# Altium schematic sheet power.SchDoc
size A2
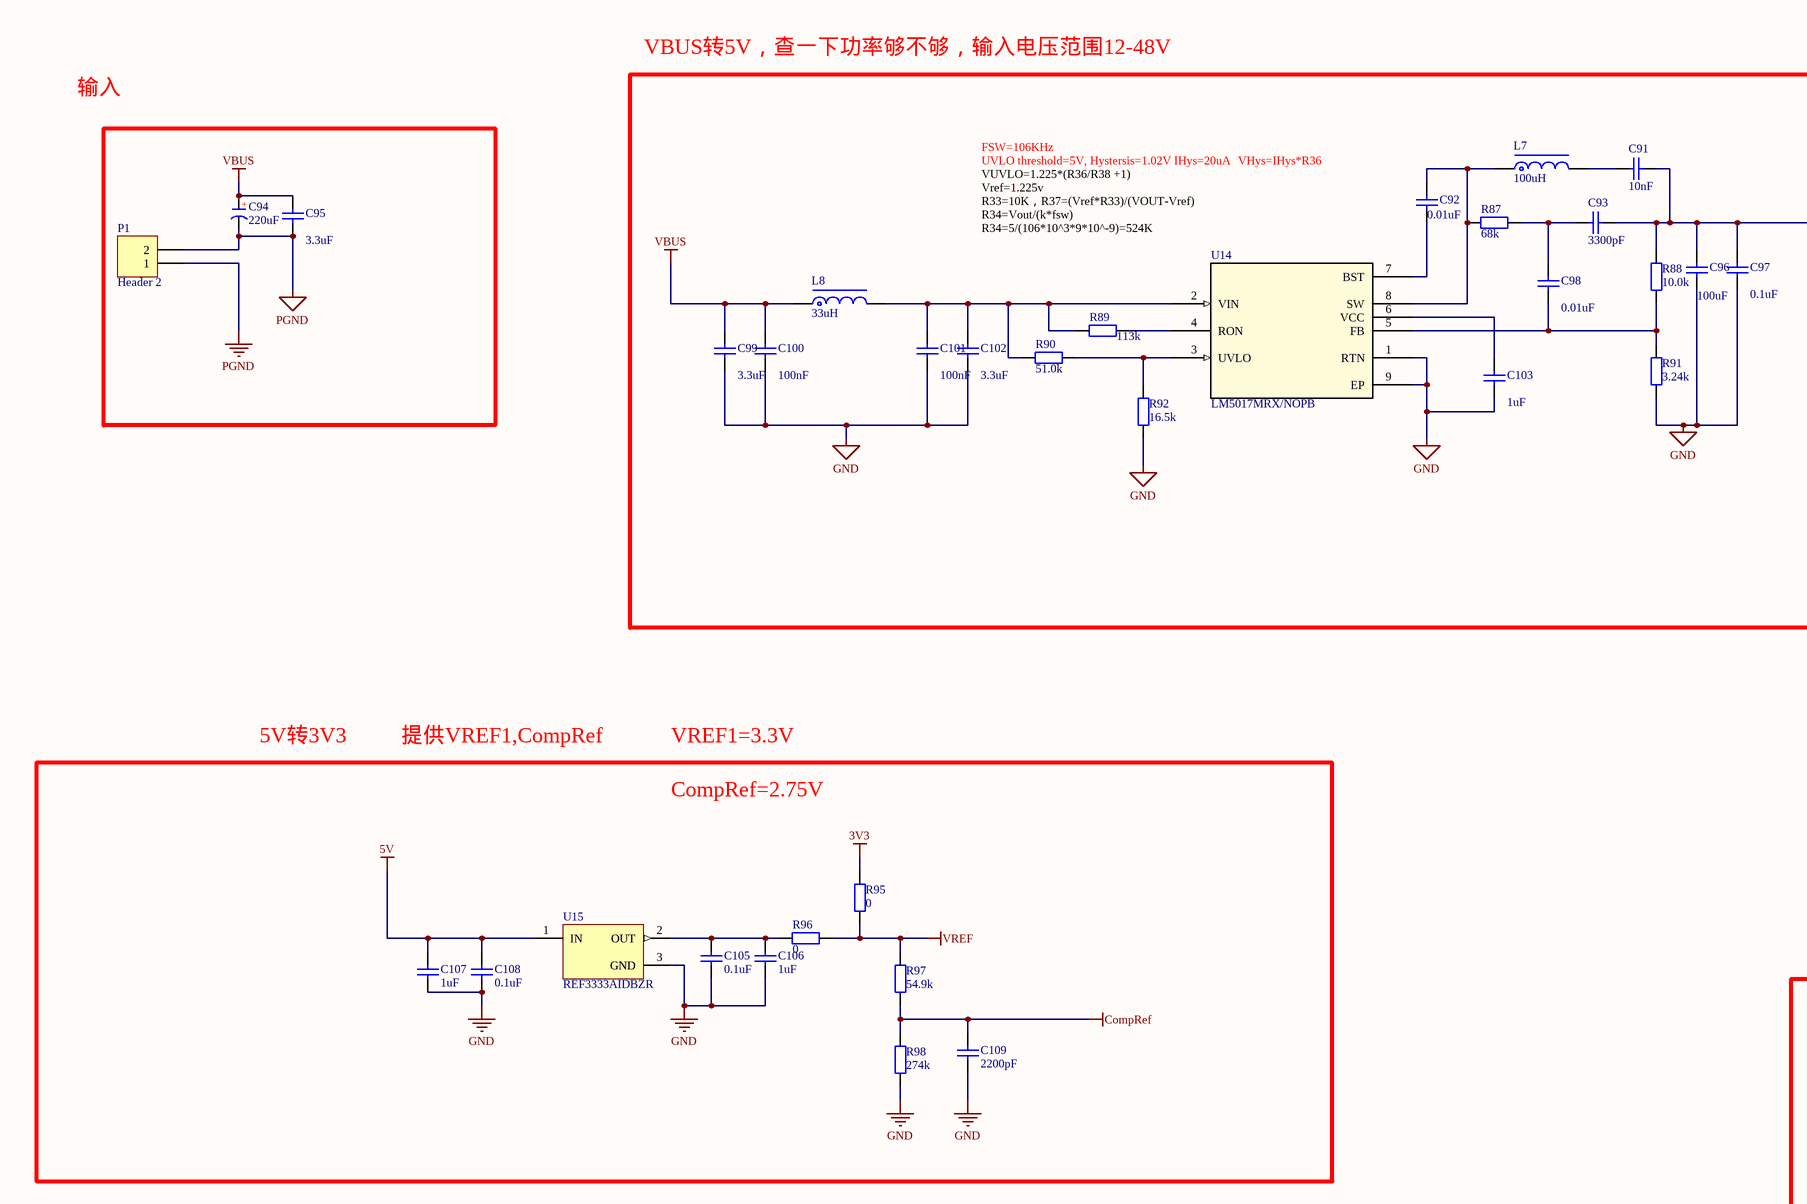
[diagram p0: power.SchDoc, left]
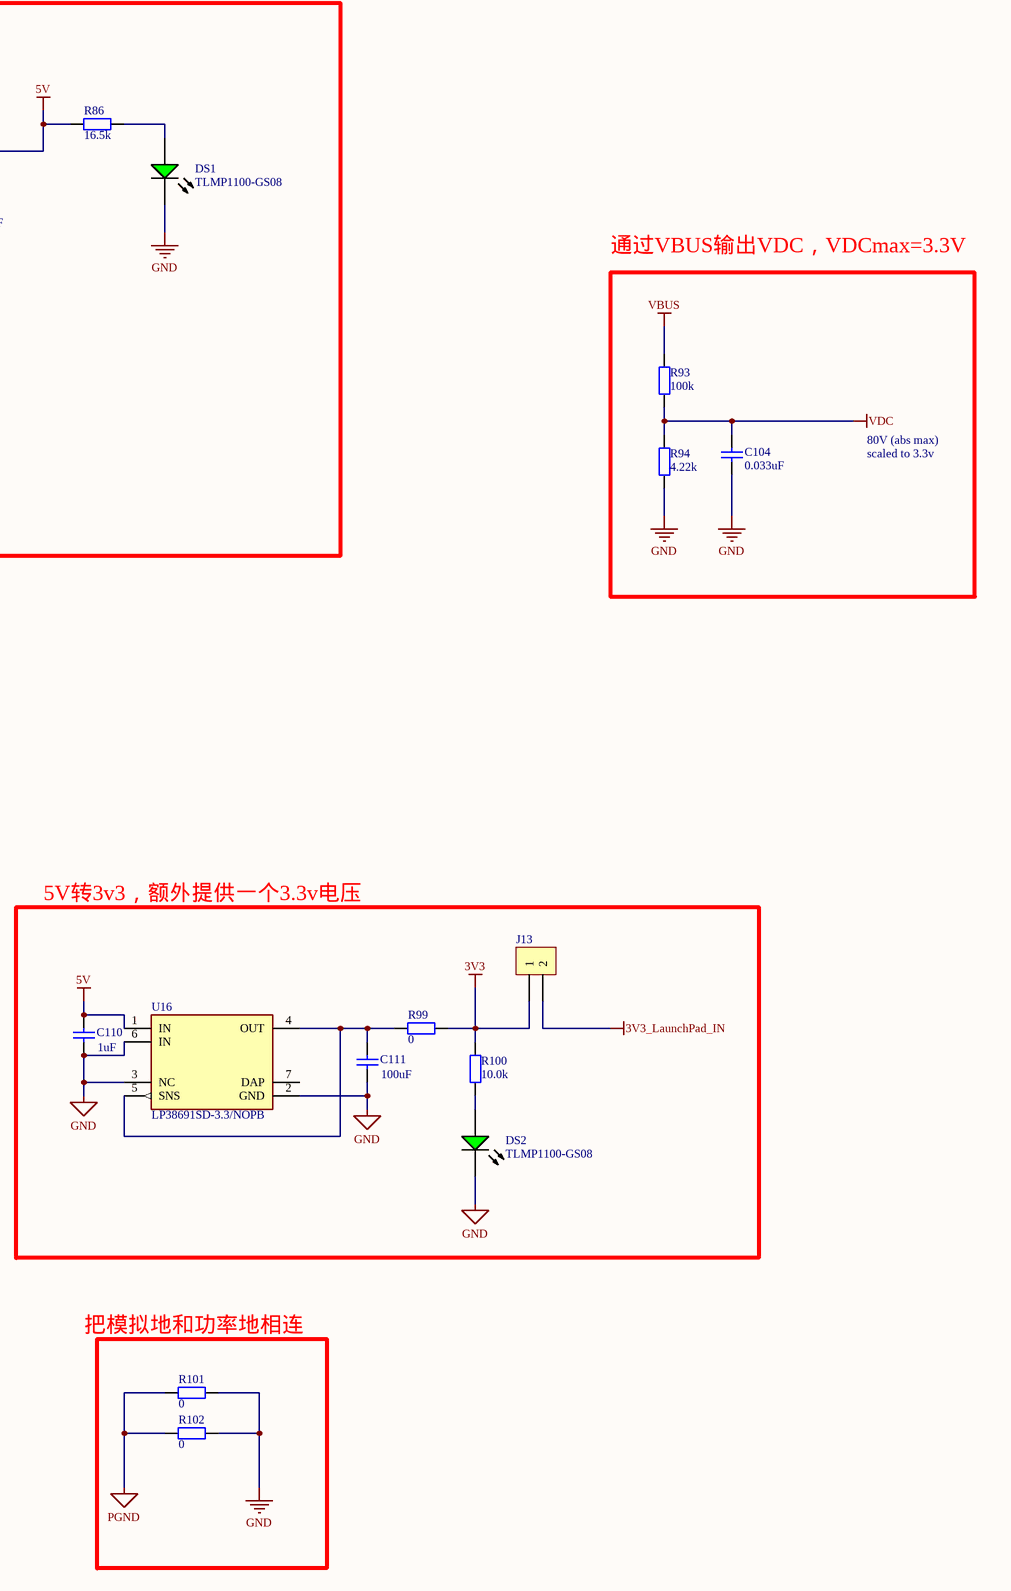
[diagram p1: power.SchDoc, right]

## Parts
C91  10nF  [CAPC1608X06N]
C92  0.01uF  [CAPC1608X06N]
C93  3300pF  [CAPC1608X06N]
C94  220uF  [CAP 1.5*4*8]
C95  3.3uF  [CAPC1608X06N]
C96  100uF  [CAPC1608X06N]
C97  0.1uF  [CAPC1608X06N]
C98  0.01uF  [CAPC1608X06N]
C99  3.3uF  [CAPC1608X06N]
C100  100nF  [CAPC1608X06N]
C101  100nF  [CAPC1608X06N]
C102  3.3uF  [CAPC1608X06N]
C103  1uF  [CAPC1608X06N]
C104  0.033uF  [CAPC1608X06N]
C105  0.1uF  [CAPC1608X06N]
C106  1uF  [CAPC1608X06N]
C107  1uF  [CAPC1608X06N]
C108  0.1uF  [CAPC1608X06N]
C109  2200pF  [CAPC1608X06N]
C110  1uF  [CAPC1608X06N]
C111  100uF  [CAPC1608X06N]
DS1  TLMP1100-GS08  [VISH-TLMX1100_V]
DS2  TLMP1100-GS08  [VISH-TLMX1100_V]
J13  CON2  [DG1282-5.0]  (value not drawn)
L7  100uH  [NR4018]
L8  33uH  [NR2520]
P1  Header 2  [HDR1X2]
R86  16.5k  [RESC1608X05N]
R87  68k  [RESC1608X05N]
R88  10.0k  [RESC1608X05N]
R89  113k  [RESC1608X05N]
R90  51.0k  [RESC1608X05N]
R91  3.24k  [RESC1608X05N]
R92  16.5k  [RESC1608X05N]
R93  100k  [RESC1608X05N]
R94  4.22k  [RESC1608X05N]
R95  0  [RESC1608X05N]
R96  0  [RESC1608X05N]
R97  54.9k  [RESC1608X05N]
R98  274k  [RESC1608X05N]
R99  0  [RESC1608X05N]
R100  10.0k  [RESC1608X05N]
R101  0  [RESC1608X05N]
R102  0  [RESC1608X05N]
U14  LM5017MRX/NOPB  [DDA8_3P1X2P41]
U15  REF3333AIDBZR  [DBZ0003A_L]
U16  LP38691SD-3.3/NOPB  [FP-NGG0006A-MFG]

## Nets
3V3: J13.1 R95.2 R99.2 R100.2
3V3_LaunchPad_IN: J13.2
5V: C91.2 C93.1 C96.2 C97.2 C107.1 C108.1 C110.2 R86.2 R88.2 U15.1(IN) U16.1(IN)
CompRef: C109.1 R97.1 R98.2
GND: C96.1 C97.1 C99.2 C100.2 C101.2 C102.1 C103.1 C104.2 C105.2 C106.2 C107.2 C108.2 C109.2 C110.1 C111.1 DS1.2(K) DS2.2(K) R91.1 R92.1 R94.1 R98.1 R101.1 R102.1 U14.1(RTN) U14.9(EP) U15.3(GND) U16.2(GND) U16.3(NC) U16.6(IN)
PGND: C94.2(K) C95.1 P1.1 P1.2 R101.2 R102.2
VBUS: C94.1(A) C95.2 C99.1 C100.1 L8.1 R93.2
VDC: C104.1 R93.1 R94.2
VREF: R95.1 R96.2 R97.2
NetC91_1: C91.1 L7.2
NetC92_1: C92.1 U14.7(BST)
NetC92_2: C92.2 L7.1 R87.2 U14.8(SW)
NetC93_2: C93.2 C98.2 R87.1
NetC98_1: C98.1 R88.1 R91.2 U14.5(FB)
NetC101_1: C101.1 C102.2 L8.2 R89.1 R90.1 U14.2(VIN)
NetC103_2: C103.2 U14.6(VCC)
NetC105_1: C105.1 C106.1 R96.1 U15.2(OUT)
NetC111_2: C111.2 R99.1 U16.4(OUT) U16.5(SNS)
NetDS1_1: DS1.1(A) R86.1
NetDS2_1: DS2.1(A) R100.1
NetR89_2: R89.2 U14.4(RON)
NetR90_2: R90.2 R92.2 U14.3(UVLO)

Not connected (* = marked no-connect by the designer): U16 7(DAP)

## Notes on the sheet
- VBUS转5V，查一下功率够不够，输入电压范围12-48V
- 输入
- FSW=106KHz
- UVLO threshold=5V, Hystersis=1.02V IHys=20uA
- Vref=1.225v
- R33=10K，R37=(Vref*R33)/(VOUT-Vref)
- R34=Vout/(k*fsw)
- VUVLO=1.225*(R36/R38 +1)
- VHys=IHys*R36
- R34=5/(106*10^3*9*10^-9)=524K
- 通过VBUS输出VDC，VDCmax=3.3V
- 80V (abs max)
- scaled to 3.3v
- 5V转3V3
- 提供VREF1,CompRef
- VREF1=3.3V
- CompRef=2.75V
- 5V转3v3，额外提供一个3.3v电压
- 把模拟地和功率地相连
- (in symbol CE) +

## Library data of the parts
C91-C93 C95-C111 = Cap: Capacitor; Published: 8-Jun-2000; LatestRevisionDate: 17-Jul-2002; LatestRevisionNote: Re-released for DXP Platform.; PackageReference: RAD-0.3; Publisher: Altium Limited; PackageDescription: Radial Cap, Thru-Hole; 2 Leads; 0.3 in Pin Spacing
  C91: Value: 10nF
  C92 C98: Value: 0.01uF
  C93: Value: 3300pF
  C95 C99 C102: Value: 3.3uF
  C96 C111: Value: 100uF
  C97 C105 C108: Value: 0.1uF
  C100 C101: Value: 100nF
  C103 C106 C107 C110: Value: 1uF
  C104: Value: 0.033uF
  C109: Value: 2200pF
C94 = CE: 直插电解电容; 淘宝ID: 封装库来自淘宝 ID：黄晶宝石; BOM名称: 直插电解电容; 联系售后: https://shop463601444.taobao.com
DS1 DS2 = CMP-1666-00027-1_1: LED, RED, 2.1 V, -40 to 100 degC, 2-Pin SMD (0603), RoHS, Tape and Reel; Type (Capacitors): C0G; Resistance: 100000000000 Ohm; Capacitance: 12 pF; Voltage Rating: 50 V; Tolerance: 5%; Min Operating Temperature: -55degC; REACH SVHC: No SVHC; ComponentLink2Description: Datasheet; ComponentLink1URL: http://www.vishay.com/; Width: 0.8 mm; Package Quantity: 4000; PackageReference: TLMX1100; ComponentLink2URL: http://www.vishay.com/docs/83173/tlmb1100.pdf; Case/Package: 0603; Case Code (Metric): 1608; Packaging: Tape and Reel; Pins: 2; ComponentLink1Description: Manufacturer URL; Max Operating Temperature: 125degC; Height: 0.8 mm; Length: 1.6 mm; Mount: Surface Mount; PackageDescription: 2-Pin Surface Mount Device, Body 1.6 x 0.8 mm; DatasheetVersion: Rev. 2.7, 03/2016; Case Code (Imperial): 0603; Voltage Rating (DC): 50 V; RoHSCompliant: True; Radiation Hardening: No
L7 L8 = L-NR: NR磁胶电感; 版权归属: 来自淘宝 ID：黄晶宝石; BOM名称: NR磁胶电感; 联系售后: https://shop463601444.taobao.com
P1 = Header 2: Header, 2-Pin; LatestRevisionDate: 17-Jul-2002; LatestRevisionNote: Re-released for DXP Platform.; Publisher: Altium Limited
R86-R102 = 0603 100KΩ (1003) 1%_4: 贴片电阻; Value: 1MΩ(1%); ComponentLink1Description: 供应商链接; ComponentLink1URL: http://www.szlcsc.com/product/details_26546.html; Package: 0603; Supplier: LC; SuppliersPartNumber: C25803
U14 = LM5017MRXNOPB: No Description Available; Mfr_Name: Texas Instruments; Copyright: Copyright (C) 2024 Ultra Librarian. All rights reserved.; Manufacturer_Part_Number: LM5017MRX/NOPB; RefDes: RefDes; Type: DEV
U15 = CMP-0367-00146-2: 30 ppm / degC Drift, 3.9 uA Voltage Reference, -40 to 125 degC, 3-pin SOT-23 (DBZ), Green (RoHS & no Sb/Br); Manufacturer: Texas Instruments; Temp Coeff(Typ)(ppm/ degree C): 8; Rating: Catalog; VO(V): 3.3; VI(Max)(V): 5.5; SubFamily: Series Voltage Reference; Iq(Max)(uA): 5; VI(Min)(V): 3.5; Temp Coeff(Max)(ppm/ degree C): 30; Initial Accuracy @ 25/deg C(%): 0.15; ComponentLink2URL: http://www.ti.com/general/docs/lit/getliterature.tsp?genericPartNumber=REF3333&fileType=pdf; ComponentLink3URL: http://www.ti.com/litv/pdf/mpds108a; Eco-Plan: Green (RoHS & no Sb/Br); ComponentLink1URL: http://www.ti.com/; Mounting Technology: Surface Mount; PartNumber: REF3333AIDBZR; ComponentLink2Description: Datasheet; PackageReference: DBZ0003A; ComponentLink4Description: URL Link1; PackageDescription: 3-Pin Plastic Small Outline, Body 2.92 x 1.3 mm, Pitch 0.95 mm; ComponentLink1Description: Manufacturer URL; Code_JEDEC: TO-236; ComponentLink3Description: Package Specification; PackageVersion: 4203227/B; ComponentLink4URL: Samples URL:http://www.ti.com/product/ref3333; DatasheetVersion: SBOS392A; Iout/Iz(Max)(mA): 5
U16 = CMP-0062-01590-5: IC REG LINEAR 3.3V 500MA 6WSON; Min Input Voltage: 2.7V; Number of Regulators: 1; Polarity: Positive; Dropout Voltage: 330mV; Output Type: Fixed; Output Voltage Accuracy: 2%; Max Input Voltage: 10V; Quiescent Current: 100uA; Max Output Current: 500mA; Output Current: 500mA; Package Quantity: 1000; Nominal Output Voltage: 3.3V; Number of Pins: 6; Number of Outputs: 1; Length: 3mm; Output Voltage: 3.3V; Height: 0.86mm; REACH SVHC: No SVHC; Accuracy: 2%; Lead Free: Lead Free; Mount: Surface Mount; Packaging: Tape and Reel; Contact Plating: Tin; Max Operating Temperature: 125°C; Min Operating Temperature: -40°C; Radiation Hardening: No; Width: 3mm